# Altium schematic sheet Ranging.SchDoc
size C
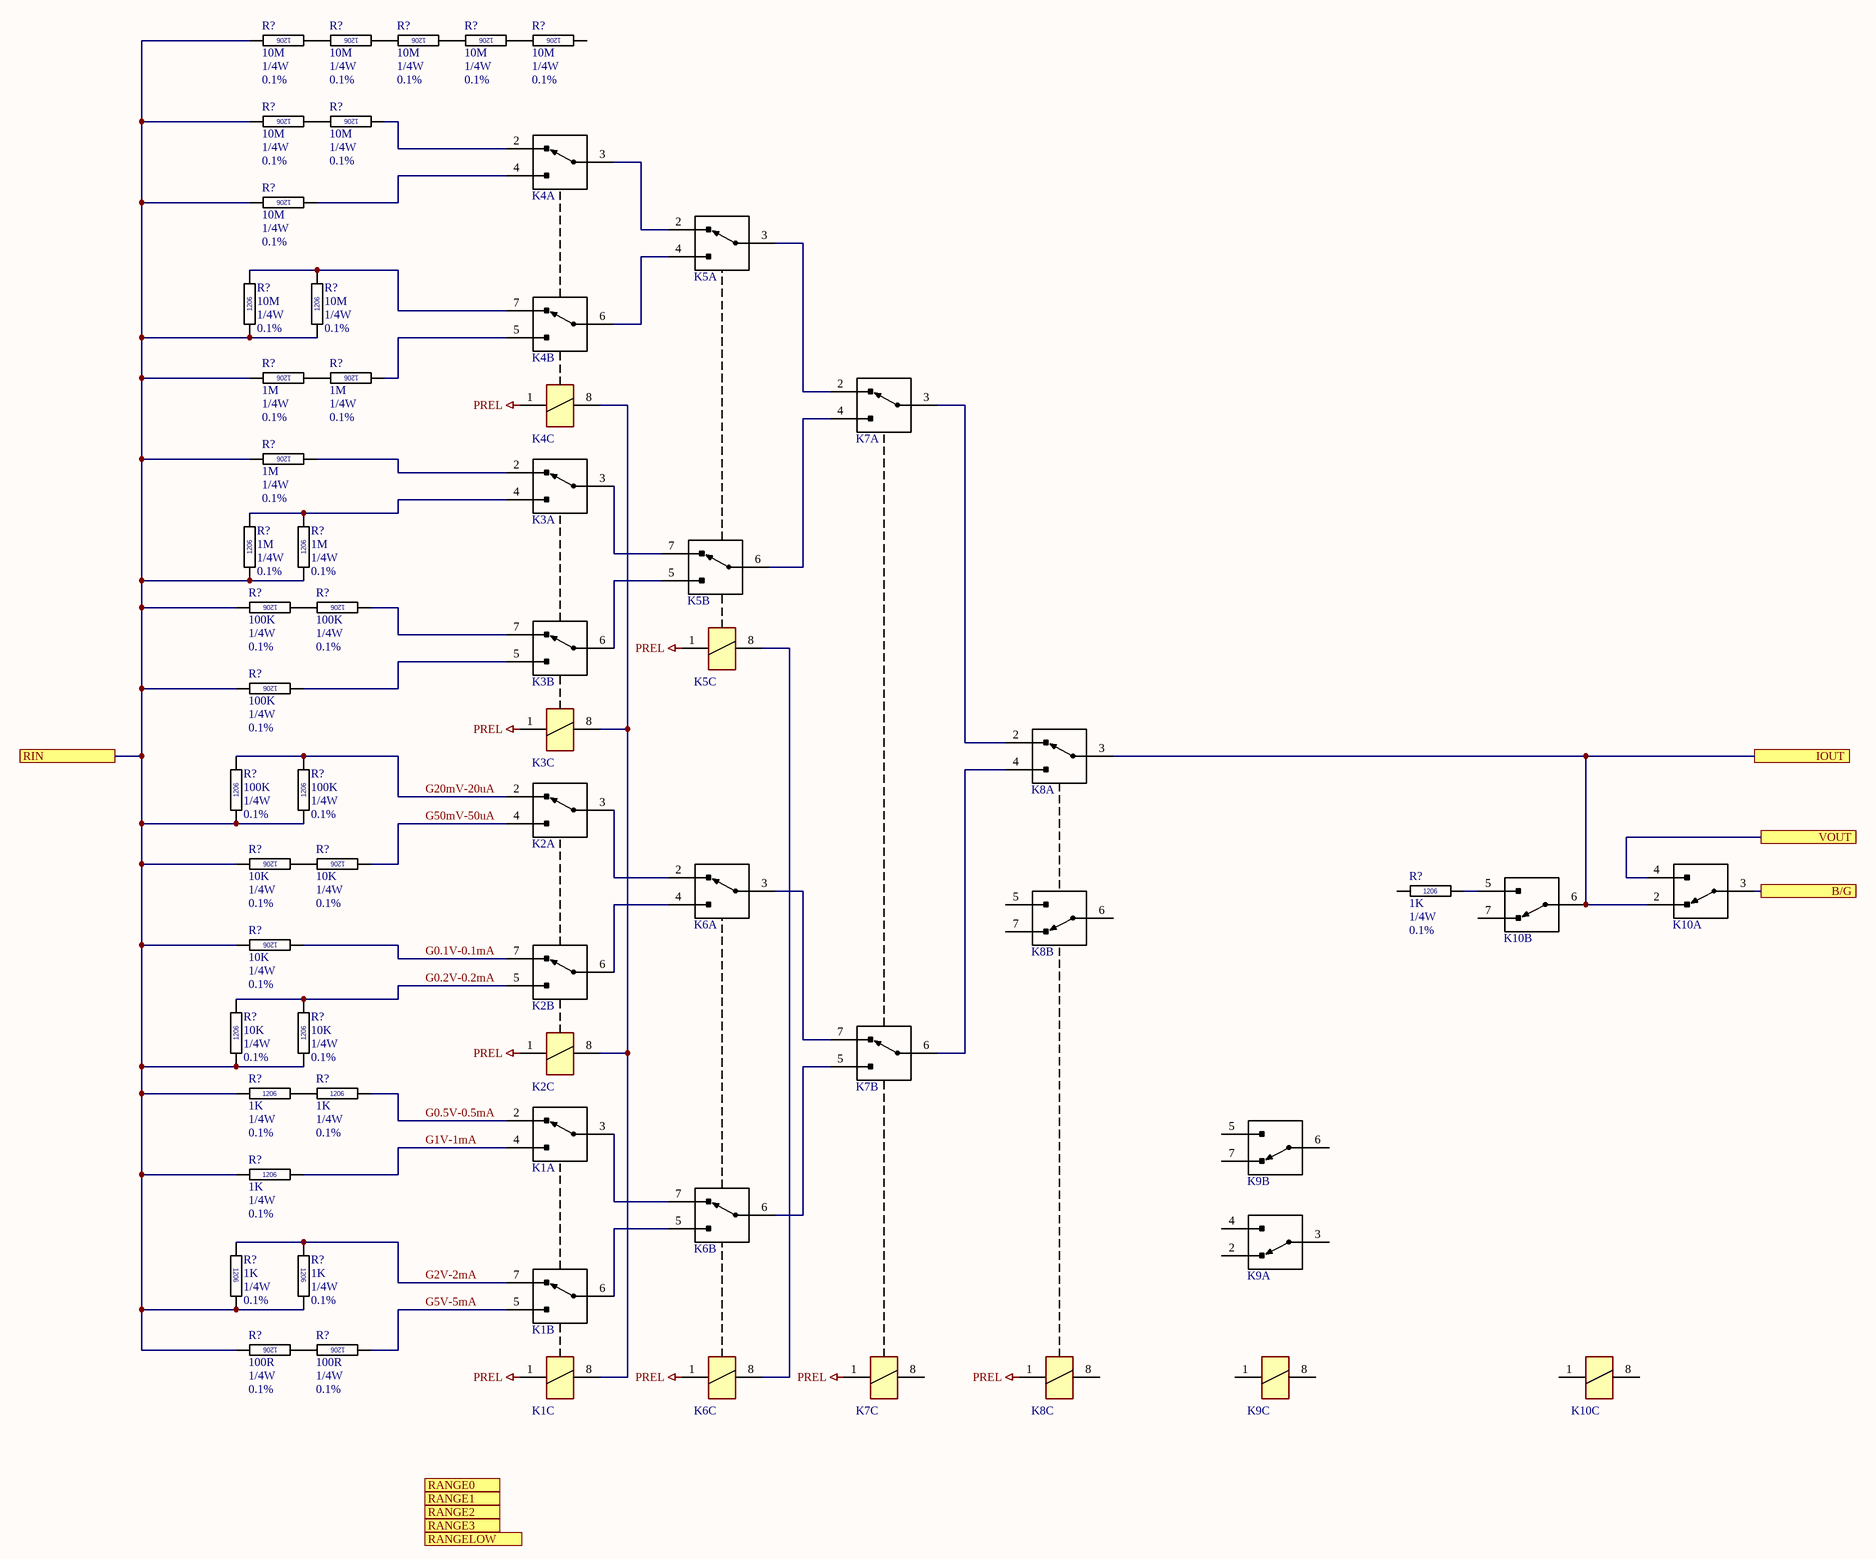
[diagram p0: Ranging.SchDoc]

## Parts
(Parts that share a designator on the sheet are numbered #1, #2 ... from top to bottom, then left to right.)
K1  RELA-OMRON-OMRON G6K-2F-Y-TR DC5  (value not drawn)  (parts A,B,C of 3)
K2  RELA-OMRON-OMRON G6K-2F-Y-TR DC5  (value not drawn)  (parts A,B,C of 3)
K3  RELA-OMRON-OMRON G6K-2F-Y-TR DC5  (value not drawn)  (parts A,B,C of 3)
K4  RELA-OMRON-OMRON G6K-2F-Y-TR DC5  (value not drawn)  (parts A,B,C of 3)
K5  RELA-OMRON-OMRON G6K-2F-Y-TR DC5  (value not drawn)  (parts A,B,C of 3)
K6  RELA-OMRON-OMRON G6K-2F-Y-TR DC5  (value not drawn)  (parts A,B,C of 3)
K7  RELA-OMRON-OMRON G6K-2F-Y-TR DC5  (value not drawn)  (parts A,B,C of 3)
K8  RELA-OMRON-OMRON G6K-2F-Y-TR DC5  (value not drawn)  (parts A,B,C of 3)
K9  RELA-OMRON-OMRON G6K-2F-Y-TR DC5  (value not drawn)  (parts A,B,C of 3)
K10  RELA-OMRON-OMRON G6K-2F-Y-TR DC5  (value not drawn)  (parts A,B,C of 3)
R?#1  value 10M  Power: 1/4W  Tolerance: 0.1%  [RESC1206]  (hidden comment: RESC1206)
R?#2  value 10M  Power: 1/4W  Tolerance: 0.1%  [RESC1206]  (hidden comment: RESC1206)
R?#3  value 10M  Power: 1/4W  Tolerance: 0.1%  [RESC1206]  (hidden comment: RESC1206)
R?#4  value 10M  Power: 1/4W  Tolerance: 0.1%  [RESC1206]  (hidden comment: RESC1206)
R?#5  value 10M  Power: 1/4W  Tolerance: 0.1%  [RESC1206]  (hidden comment: RESC1206)
R?#6  value 10M  Power: 1/4W  Tolerance: 0.1%  [RESC1206]  (hidden comment: RESC1206)
R?#7  value 10M  Power: 1/4W  Tolerance: 0.1%  [RESC1206]  (hidden comment: RESC1206)
R?#8  value 10M  Power: 1/4W  Tolerance: 0.1%  [RESC1206]  (hidden comment: RESC1206)
R?#9  value 10M  Power: 1/4W  Tolerance: 0.1%  [RESC1206]  (hidden comment: RESC1206)
R?#10  value 10M  Power: 1/4W  Tolerance: 0.1%  [RESC1206]  (hidden comment: RESC1206)
R?#11  value 1M  Power: 1/4W  Tolerance: 0.1%  [RESC1206]  (hidden comment: RESC1206)
R?#12  value 1M  Power: 1/4W  Tolerance: 0.1%  [RESC1206]  (hidden comment: RESC1206)
R?#13  value 1M  Power: 1/4W  Tolerance: 0.1%  [RESC1206]  (hidden comment: RESC1206)
R?#14  value 1M  Power: 1/4W  Tolerance: 0.1%  [RESC1206]  (hidden comment: RESC1206)
R?#15  value 1M  Power: 1/4W  Tolerance: 0.1%  [RESC1206]  (hidden comment: RESC1206)
R?#16  value 100K  Power: 1/4W  Tolerance: 0.1%  [RESC1206]  (hidden comment: RESC1206)
R?#17  value 100K  Power: 1/4W  Tolerance: 0.1%  [RESC1206]  (hidden comment: RESC1206)
R?#18  value 100K  Power: 1/4W  Tolerance: 0.1%  [RESC1206]  (hidden comment: RESC1206)
R?#19  value 100K  Power: 1/4W  Tolerance: 0.1%  [RESC1206]  (hidden comment: RESC1206)
R?#20  value 100K  Power: 1/4W  Tolerance: 0.1%  [RESC1206]  (hidden comment: RESC1206)
R?#21  value 10K  Power: 1/4W  Tolerance: 0.1%  [RESC1206]  (hidden comment: RESC1206)
R?#22  value 10K  Power: 1/4W  Tolerance: 0.1%  [RESC1206]  (hidden comment: RESC1206)
R?#23  value 1K  Power: 1/4W  Tolerance: 0.1%  [RESC1206]  (hidden comment: RESC1206)
R?#24  value 10K  Power: 1/4W  Tolerance: 0.1%  [RESC1206]  (hidden comment: RESC1206)
R?#25  value 10K  Power: 1/4W  Tolerance: 0.1%  [RESC1206]  (hidden comment: RESC1206)
R?#26  value 10K  Power: 1/4W  Tolerance: 0.1%  [RESC1206]  (hidden comment: RESC1206)
R?#27  value 1K  Power: 1/4W  Tolerance: 0.1%  [RESC1206]  (hidden comment: RESC1206)
R?#28  value 1K  Power: 1/4W  Tolerance: 0.1%  [RESC1206]  (hidden comment: RESC1206)
R?#29  value 1K  Power: 1/4W  Tolerance: 0.1%  [RESC1206]  (hidden comment: RESC1206)
R?#30  value 1K  Power: 1/4W  Tolerance: 0.1%  [RESC1206]  (hidden comment: RESC1206)
R?#31  value 1K  Power: 1/4W  Tolerance: 0.1%  [RESC1206]  (hidden comment: RESC1206)
R?#32  value 100R  Power: 1/4W  Tolerance: 0.1%  [RESC1206]  (hidden comment: RESC1206)
R?#33  value 100R  Power: 1/4W  Tolerance: 0.1%  [RESC1206]  (hidden comment: RESC1206)

## Ports
B/G, IOUT, RANGE0, RANGE1, RANGE2, RANGE3, RANGELOW, RIN, VOUT

## Nets
PREL: K1.1 K2.1 K3.1 K4.1 K5.1 K6.1 K7.1 K8.1
B/G: K10.3(COM) ; port B/G
G0.1V-0.1mA: K2.7(NC) R?#24.2
G0.2V-0.2mA: K2.5(NO) R?#25.1 R?#26.1
G0.5V-0.5mA: K1.2(NC) R?#28.1
G1V-1mA: K1.4(NO) R?#29.1
G2V-2mA: K1.7(NC) R?#30.2 R?#31.2
G5V-5mA: K1.5(NO) R?#33.2
G20mV-20uA: K2.2(NC) R?#19.1 R?#20.1
G50mV-50uA: K2.4(NO) R?#22.2
IOUT: K8.3(COM) K10.2(NC) K10.6(COM) ; port IOUT
RIN: R?#1.1 R?#6.1 R?#8.1 R?#9.2 R?#10.2 R?#11.1 R?#13.1 R?#14.2 R?#15.2 R?#16.1 R?#18.1 R?#19.2 R?#20.2 R?#21.1 R?#24.1 R?#25.2 R?#26.2 R?#27.2 R?#29.2 R?#30.1 R?#31.1 R?#32.1 ; port RIN
VOUT: K10.4(NO) ; port VOUT
NetK1_3: K1.3(COM) K6.7(NC)
NetK1_6: K1.6(COM) K6.5(NO)
NetK1_8: K1.8 K2.8 K3.8 K4.8
NetK2_3: K2.3(COM) K6.2(NC)
NetK2_6: K2.6(COM) K6.4(NO)
NetK3_2: K3.2(NC) R?#13.2
NetK3_3: K3.3(COM) K5.7(NC)
NetK3_4: K3.4(NO) R?#14.1 R?#15.1
NetK3_5: K3.5(NO) R?#18.2
NetK3_6: K3.6(COM) K5.5(NO)
NetK3_7: K3.7(NC) R?#17.2
NetK4_2: K4.2(NC) R?#7.2
NetK4_3: K4.3(COM) K5.2(NC)
NetK4_4: K4.4(NO) R?#8.2
NetK4_5: K4.5(NO) R?#12.2
NetK4_6: K4.6(COM) K5.4(NO)
NetK4_7: K4.7(NC) R?#9.1 R?#10.1
NetK5_3: K5.3(COM) K7.2(NC)
NetK5_6: K5.6(COM) K7.4(NO)
NetK5_8: K5.8 K6.8
NetK6_3: K6.3(COM) K7.7(NC)
NetK6_6: K6.6(COM) K7.5(NO)
NetK7_3: K7.3(COM) K8.2(NC)
NetK7_6: K7.6(COM) K8.4(NO)
NetK10_5: K10.5(NO) R?#23.1
NetR?#1_2: R?#1.2 R?#2.1
NetR?#2_2: R?#2.2 R?#3.1
NetR?#3_2: R?#3.2 R?#4.1
NetR?#4_2: R?#4.2 R?#5.1
NetR?#6_2: R?#6.2 R?#7.1
NetR?#11_2: R?#11.2 R?#12.1
NetR?#16_2: R?#16.2 R?#17.1
NetR?#21_2: R?#21.2 R?#22.1
NetR?#27_1: R?#27.1 R?#28.2
NetR?#32_2: R?#32.2 R?#33.1

Not connected (* = marked no-connect by the designer): K7 8; K8 5(NO) 6(COM) 7(NC) 8; K9 1 2(NC) 3(COM) 4(NO) 5(NO) 6(COM) 7(NC) 8; K10 1 7(NC) 8; R?#5 2; R?#23 2

## Notes on the sheet
- (in symbol RESC-1206-1K-0.1%-1/4W) 1206
- (in symbol RESC-1206-1M-0.1%-1/4W) 1206
- (in symbol RESC-1206-10K-0.1%-1/4W) 1206
- (in symbol RESC-1206-10M-0.1%-1/4W) 1206
- (in symbol RESC-1206-100K-0.1%-1/4W) 1206
- (in symbol RESC-1206-100R-0.1%-1/4W) 1206

## Library data of the parts
R?#1-R?#10 = RESC-1206-10M-0.1%-1/4W: RESISTOR,10M,1206,0.1%,125mW,1206; Location: *; Parameter 4: *
R?#11-R?#15 = RESC-1206-1M-0.1%-1/4W: RESISTOR,1M,1206,0.1%,125mW,1206; Location: *; Parameter 4: *
R?#16-R?#20 = RESC-1206-100K-0.1%-1/4W: RESISTOR,100K,1206,0.1%,125mW,1206; Location: *; Parameter 4: *
R?#21 R?#22 R?#24-R?#26 = RESC-1206-10K-0.1%-1/4W: RESISTOR,10K,1206,0.1%,125mW,1206; Location: *; Parameter 4: *
R?#23 R?#27-R?#31 = RESC-1206-1K-0.1%-1/4W: RESISTOR,1K,1206,0.1%,125mW,1206; Location: *; Parameter 4: *
R?#32 R?#33 = RESC-1206-100R-0.1%-1/4W: RESISTOR,100R,1206,0.1%,125mW,0805; Location: *; Parameter 4: *